# Altium schematic sheet Ethernet.SchDoc: Ethernet
size A3
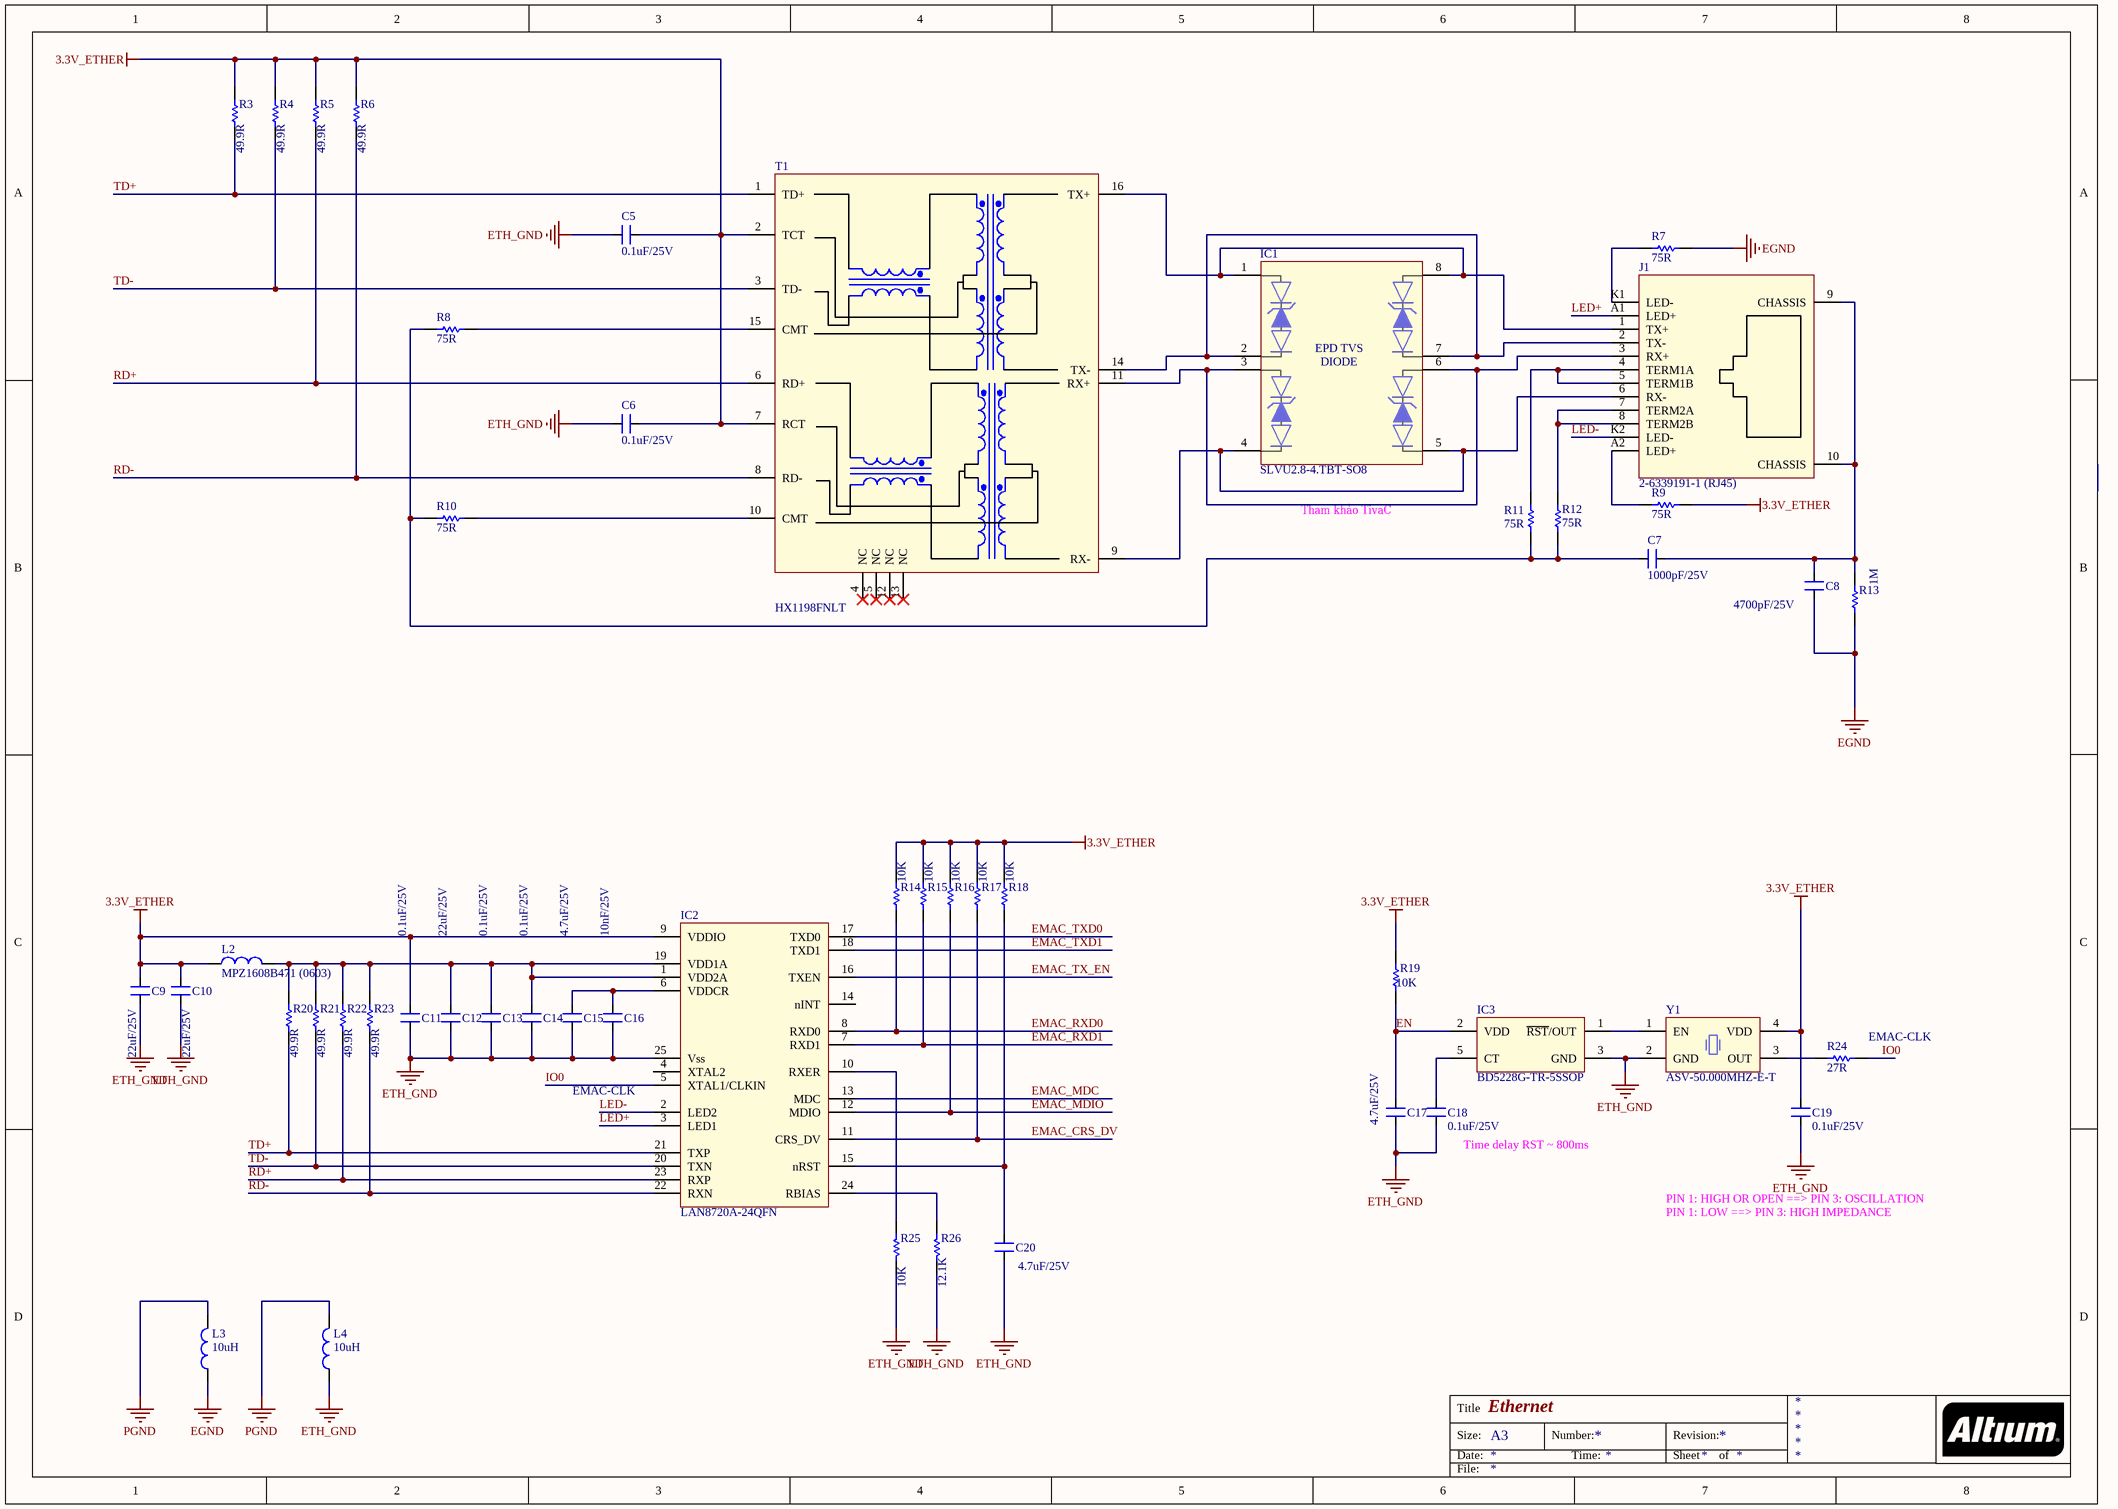
[diagram p0: Ethernet.SchDoc]

## Parts
C5  0.1uF/25V  [CAP_CERA_C2012(CC0805INCH)]
C6  0.1uF/25V  [CAP_CERA_C2012(CC0805INCH)]
C7  1000pF/25V  [CAP_CERA_C2012(CC0805INCH)]
C8  4700pF/25V  [CAP_CERA_C2012(CC0805INCH)]
C9  22uF/25V  [CAP_CERA_C2012(CC0805INCH)]
C10  22uF/25V  [CAP_CERA_C2012(CC0805INCH)]
C11  0.1uF/25V  [CAP_CERA_C2012(CC0805INCH)]
C12  22uF/25V  [CAP_CERA_C2012(CC0805INCH)]
C13  0.1uF/25V  [CAP_CERA_C2012(CC0805INCH)]
C14  0.1uF/25V  [CAP_CERA_C2012(CC0805INCH)]
C15  4.7uF/25V  [CAP_CERA_C2012(CC0805INCH)]
C16  10nF/25V  [CAP_CERA_C2012(CC0805INCH)]
C17  4.7uF/25V  [CAP_CERA_C2012(CC0805INCH)]
C18  0.1uF/25V  [CAP_CERA_C2012(CC0805INCH)]
C19  0.1uF/25V  [CAP_CERA_C2012(CC0805INCH)]
C20  4.7uF/25V  [CAP_CERA_C2012(CC0805INCH)]
IC1  SLVU2.8-4.TBT-SO8  [SLVU2.8-4.TBT - 8S0]
IC2  LAN8720A-24QFN  [LAN8720A 24QFN]
IC3  BD5228G-TR-5SSOP  [BD5228G -5SSOP]
J1  2-6339191-1 (RJ45)  [RJ45-A121555CT-ND]
L2  MPZ1608B471 (0603)  [MPZ1608B471]
L3  10uH  [L/0.4]
L4  10uH  [L/0.4]
R3  49.9R  [Res 0805 SMD]
R4  49.9R  [Res 0805 SMD]
R5  49.9R  [Res 0805 SMD]
R6  49.9R  [Res 0805 SMD]
R7  75R  [Res 0805 SMD]
R8  75R  [Res 0805 SMD]
R9  75R  [Res 0805 SMD]
R10  75R  [Res 0805 SMD]
R11  75R  [Res 0805 SMD]
R12  75R  [Res 0805 SMD]
R13  1M  [Res 0805 SMD]
R14  10K  [Res 0805 SMD]
R15  10K  [Res 0805 SMD]
R16  10K  [Res 0805 SMD]
R17  10K  [Res 0805 SMD]
R18  10K  [Res 0805 SMD]
R19  10K  [Res 0805 SMD]
R20  49.9R  [Res 0805 SMD]
R21  49.9R  [Res 0805 SMD]
R22  49.9R  [Res 0805 SMD]
R23  49.9R  [Res 0805 SMD]
R24  27R  [Res 0805 SMD]
R25  10K  [Res 0805 SMD]
R26  12.1K  [Res 0805 SMD]
T1  HX1198FNLT  [HX1198FNL]
Y1  ASV-50.000MHZ-E-T  [CR_ASV_50.000MHZ]

## Nets
3.3V_ETHER: C5.1 C6.1 C9.2 C10.2 C11.2 C19.2 IC2.9(VDDIO) L2.1 R3.1 R4.1 R5.1 R6.1 R9.1 R14.1 R15.1 R16.1 R17.1 R18.1 R19.1 T1.2(TCT) T1.7(RCT) Y1.4(VDD)
EGND: C8.2 L3.1 R7.1 R13.1
ETH_GND: C5.2 C6.2 C9.1 C10.1 C11.1 C12.1 C13.1 C14.1 C15.1 C16.1 C17.1 C18.1 C19.1 C20.1 IC2.25(Vss) IC3.3(GND) L4.1 R25.2 R26.2 Y1.2(GND)
PGND: L3.2 L4.2
EMAC_CRS_DV: IC2.11(CRS_DV) R17.2
EMAC_MDC: IC2.13(MDC)
EMAC_MDIO: IC2.12(MDIO) R16.2
EMAC_RXD0: IC2.8(RXD0) R14.2
EMAC_RXD1: IC2.7(RXD1) R15.2
EMAC_TX_EN: IC2.16(TXEN)
EMAC_TXD0: IC2.17(TXD0)
EMAC_TXD1: IC2.18(TXD1)
EN: C17.2 IC3.2(VDD) R19.2
IO0: IC2.5(XTAL1/CLKIN) R24.2
LED+: IC2.3(LED1) J1.A1(LED+)
LED-: IC2.2(LED2) J1.K2(LED-)
RD+: IC2.23(RXP) R5.2 R22.1 T1.6(RD+)
RD-: IC2.22(RXN) R6.2 R23.1 T1.8(RD-)
TD+: IC2.21(TXP) R3.2 R20.1 T1.1(TD+)
TD-: IC2.20(TXN) R4.2 R21.1 T1.3(TD-)
NetC7_1: C7.1 C8.1 J1.9(CHASSIS) J1.10(CHASSIS) R13.2
NetC7_2: C7.2 R8.2 R10.2 R11.1 R12.1
NetC12_2: C12.2 C13.2 C14.2 IC2.1(VDD2A) IC2.19(VDD1A) L2.2 R20.2 R21.2 R22.2 R23.2
NetC15_2: C15.2 C16.2 IC2.6(VDDCR)
NetC18_2: C18.2 IC3.5(CT)
NetC20_2: C20.2 IC2.15(nRST) R18.2
NetIC1_1: IC1.1(A1) IC1.8(A1) J1.1(TX+) T1.16(TX+)
NetIC1_2: IC1.2(K1) IC1.7(K1) J1.2(TX-) T1.14(TX-)
NetIC1_3: IC1.3(A1) IC1.6(A1) J1.3(RX+) T1.11(RX+)
NetIC1_4: IC1.4(K1) IC1.5(K1) J1.6(RX-) T1.9(RX-)
NetIC2_10: IC2.10(RXER) R25.1
NetIC2_24: IC2.24(RBIAS) R26.1
NetIC3_1: IC3.1(~{RST}/OUT) Y1.1(EN)
NetJ1_4: J1.4(TERM1A) J1.5(TERM1B) R11.2
NetJ1_7: J1.7(TERM2A) J1.8(TERM2B) R12.2
NetJ1_A2: J1.A2(LED+) R9.2
NetJ1_K1: J1.K1(LED-) R7.2
NetR8_1: R8.1 T1.15(CMT)
NetR10_1: R10.1 T1.10(CMT)
NetR24_1: R24.1 Y1.3(OUT)

Not connected (* = marked no-connect by the designer): IC2 4(XTAL2) 14(nINT); T1 4(NC)* 5(NC)* 12(NC)* 13(NC)*

## Notes on the sheet
- Tham khảo TivaC
- (near R24) EMAC-CLK
- EMAC-CLK
- (near C18) Time delay RST ~ 800ms
- PIN 1: HIGH OR OPEN ==> PIN 3: OSCILLATION
- PIN 1: LOW ==> PIN 3: HIGH IMPEDANCE
- Title
- Size:
- Date:
- A3
- Number:
- Time:
- Revision:
- Sheet
- of
- File:
- (in symbol SLVU2.8-4.TBT) EPD TVS; DIODE

## Library data of the parts
C5 C6 C11 C13 C14 C18 C19 = CAP CERA 0805: 0.1µF ±10% 25V Ceramic Capacitor X7R 0805 (2012 Metric); Value: 100pF, 2012; Digikey: 478-3755-1-ND
C7 = CAP CERA 0805: 1000pF ±10% 25V Ceramic Capacitor X7R 0805 (2012 Metric); Manufacturrer: Wurth Electronics Inc.; Digikey: 732-8050-1-ND
C8 = CAP CERA 0805: 4700pF ±10% 25V Ceramic Capacitor X7R 0805 (2012 Metric); Manufacturrer: KEMET; Digikey: 399-14606-1-ND
C9 C10 C12 = CAP CERA 0805: 22µF ±20% 25V Ceramic Capacitor X5R 0805 (2012 Metric); Digikey: 1276-2908-1-ND
C15 C17 C20 = CAP CERA 0805: 4.7µF ±10% 25V Ceramic Capacitor X5R 0805 (2012 Metric); Digikey: 399-5505-1-ND
C16 = CAP CERA 0805: 1nF=1000pF ±10% 25V Ceramic Capacitor X7R 0805 (2012 Metric); Digikey: 399-7994-1-ND
IC1 = SLVU2.8-4.TBT: TVS DIODE 2.8V 15V 8SO, EPD TVS Diode Array For ESD and Latch-Up Protection; Digikey: SLVU2.8-4CT-ND
IC2 = LAN8720A-24QFN: IC TXRX ETHERNET 24QFN,  2/2 Transceiver Full RMII 24-QFN (4x4); Digikey: LAN8720A-CP-CT-ND
IC3 = BD5228G-5SSOP: IC DETECTOR VOLT 2.8V ODRN 5SSOP; Digikey: BD5228GCT-ND
J1 = RJ45-2-6339191-1: Jack Modular Connector 8p8c (RJ45, Ethernet) 90° Angle (Right) Shielded, EMI Finger Cat5; Digikey: A121555CT-ND
L2 = L1: FERRITE BEAD 470 OHM 0603 1LN; Digikey: 445-5218-1-ND
L3 L4 = L1: Inductor; Value: 150 mH
R3-R6 R20-R23 = RES-0805: 49.9 Ohms ±1% 0.15W Chip Resistor 0805 (2012 Metric) Military Thick Film; ComponentLink1URL: http://www.yageo.com/documents/recent/PYu-RC_Group_51_RoHS_L_8.pdf; ComponentLink1Description: http://www.yageo.com/documents/recent/PYu-RC_Group_51_RoHS_L_8.pdf; Digikey: 1135-1012-1-ND
R7-R12 = RES-0805: 75 Ohms ±1% 0.125W, 1/8W Chip Resistor 0805 (2012 Metric) Automotive AEC-Q200 Thick Film; ComponentLink1URL: http://www.yageo.com/documents/recent/PYu-RC_Group_51_RoHS_L_8.pdf; ComponentLink1Description: http://www.yageo.com/documents/recent/PYu-RC_Group_51_RoHS_L_8.pdf; Digikey: P75.0CCT-ND
R13 = RES-0805: 1 MOhms ±1% 0.125W, 1/8W Chip Resistor 0805 (2012 Metric) Automotive AEC-Q200 Thick Film; ComponentLink1URL: http://www.yageo.com/documents/recent/PYu-RC_Group_51_RoHS_L_8.pdf; ComponentLink1Description: http://www.yageo.com/documents/recent/PYu-RC_Group_51_RoHS_L_8.pdf; Digikey: P1.00MCCT-ND
R14-R19 R25 = RES-0805: RES SMD 249K OHM 1% 1/10W 0805; Manufacturer: Yageo; Manufacturer Part Number: RC0603FR-07249KL; Power (Watts): 0.1W, 1/10W; Temperature Coefficient: ±100ppm/°C; Supplier 1: Digi-Key; RoHS: RoHS Compliant; Category: Resistors; Stock 1: 370515; Pricing 1: 1=0.1, 10=0.015, 100=0.006, 1000=0.00268, 2500=0.00233 (USD); Packaging: Cut Tape (CT); Part Status: Active; Tolerance: ±1%; Composition: Thick Film; Features: Moisture Resistant; Operating Temperature: -55°C ~ 155°C; Package / Case: 0603 (1608 Metric); Supplier Device Package: 0603; Size / Dimension: 0.063" L x 0.032" W (1.60mm x 0.80mm); Height - Seated (Max): 0.022" (0.55mm); Failure Rate: -; ComponentLink1URL: http://www.yageo.com/documents/recent/PYu-RC_Group_51_RoHS_L_8.pdf; ComponentLink1Description: http://www.yageo.com/documents/recent/PYu-RC_Group_51_RoHS_L_8.pdf
R24 = RES-0805: 27 Ohms ±1% 0.125W, 1/8W Chip Resistor 0805 (2012 Metric) Automotive AEC-Q200 Thick Fil; ComponentLink1URL: http://www.yageo.com/documents/recent/PYu-RC_Group_51_RoHS_L_8.pdf; ComponentLink1Description: http://www.yageo.com/documents/recent/PYu-RC_Group_51_RoHS_L_8.pdf; Digikey: P27.0CCT-ND
R26 = RES-0805: 12.1 kOhms ±1% 0.125W, 1/8W Chip Resistor 0805 (2012 Metric) Automotive AEC-Q200 Thick Film; ComponentLink1URL: http://www.yageo.com/documents/recent/PYu-RC_Group_51_RoHS_L_8.pdf; ComponentLink1Description: http://www.yageo.com/documents/recent/PYu-RC_Group_51_RoHS_L_8.pdf; Digikey: P12.1KCCT-ND
T1 = HX1198FNLT: PULSE XFMR 1CT:1CT TX 1CT:1CT RX; Digikey: 553-2209-1-ND
Y1 = CRYSTAL_ASV: 50MHz XO (Standard) HCMOS Oscillator 3.3V Enable/Disable 4-SMD, No Lead; ComponentLink1Description: Datasheet; Digikey: 535-10087-1-ND